# Altium schematic sheet 键盘.SchDoc
size A4
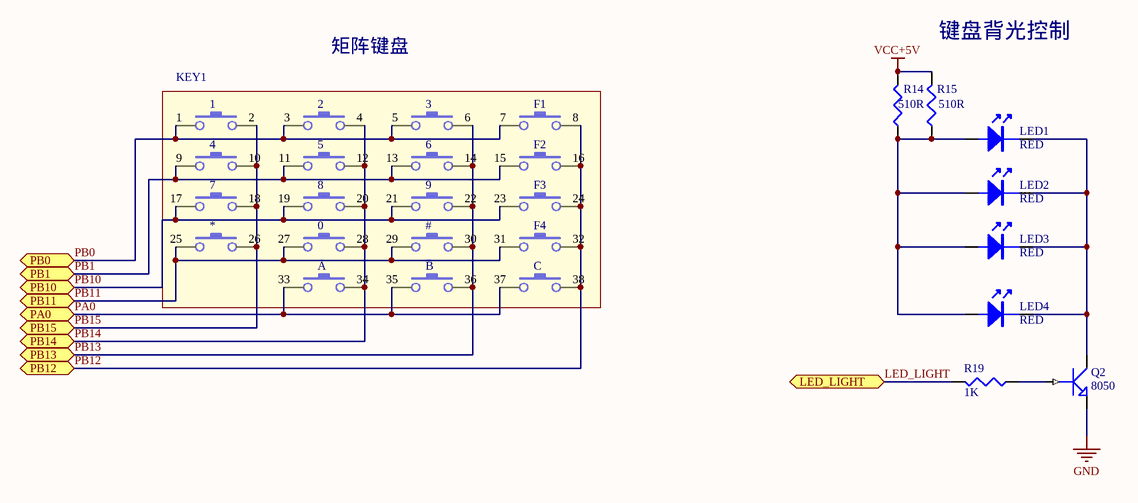
[diagram p0: 键盘.SchDoc]

## Parts
KEY1  SW-17  [KEY-17]  (value not drawn)
LED1  RED  [LED-0603]
LED2  RED  [LED-0603]
LED3  RED  [LED-0603]
LED4  RED  [LED-0603]
Q2  8050  [SOT-23]
R14  510R  [0603]
R15  510R  [0603]
R19  1K  [0603]

## Ports
LED_LIGHT, PA0, PB0, PB1, PB10, PB11, PB12, PB13, PB14, PB15

## Nets
GND: Q2.2(E)
VCC+5V: R14.2 R15.2
LED_LIGHT: R19.2 ; port LED_LIGHT
PA0: KEY1.33 KEY1.35 KEY1.37 ; port PA0
PB0: KEY1.1 KEY1.3 KEY1.5 KEY1.7 ; port PB0
PB1: KEY1.9 KEY1.11 KEY1.13 KEY1.15 ; port PB1
PB10: KEY1.17 KEY1.19 KEY1.21 KEY1.23 ; port PB10
PB11: KEY1.25 KEY1.27 KEY1.29 KEY1.31 ; port PB11
PB12: KEY1.8 KEY1.16 KEY1.24 KEY1.32 KEY1.38 ; port PB12
PB13: KEY1.6 KEY1.14 KEY1.22 KEY1.30 KEY1.36 ; port PB13
PB14: KEY1.4 KEY1.12 KEY1.20 KEY1.28 KEY1.34 ; port PB14
PB15: KEY1.2 KEY1.10 KEY1.18 KEY1.26 ; port PB15
NetLED1_1: LED1.1 LED2.1 LED3.1 LED4.1 R14.1 R15.1
NetLED1_2: LED1.2 LED2.2 LED3.2 LED4.2 Q2.3(C)
NetQ2_1: Q2.1(B) R19.1

## Notes on the sheet
- 矩阵键盘
- 键盘背光控制
- (near KEY1) 1
- (near KEY1) 4
- (near KEY1) 2
- (near KEY1) 5
- (near KEY1) 3
- (near KEY1) 6
- (near KEY1) F1
- (near KEY1) F2
- (near KEY1) 7
- (near KEY1) 8
- (near KEY1) 9
- (near KEY1) F3
- (near KEY1) *
- (near KEY1) 0
- (near KEY1) A
- (near KEY1) #
- (near KEY1) B
- (near KEY1) F4
- (near KEY1) C

## Library data of the parts
KEY1 = SW-17: 终端操作按键
LED1-LED4 = LED-0603: LED贴片发光二极管0603封装
Q2 = 8050: 8050 NPN型三极管
R14 R15 R19 = RES-0603: 陶瓷贴片电阻0603封装